# EAGLE design Bootselector (EAGLE 8.5.1)
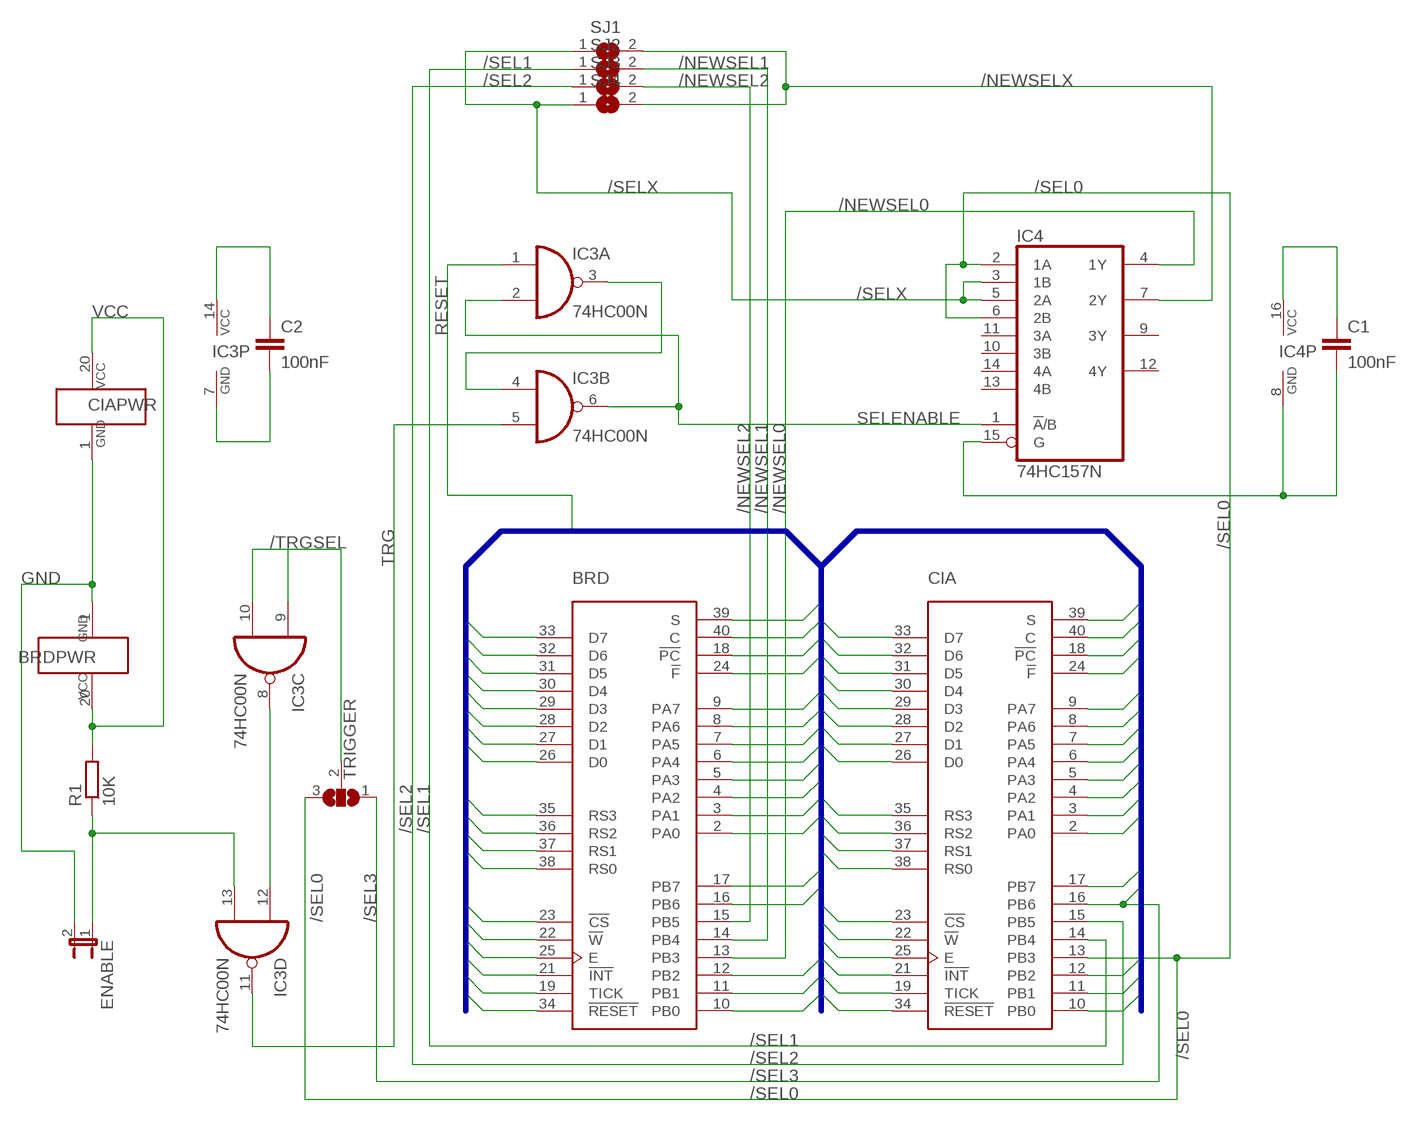
[diagram p0: schematic, sheet 1]

## Parts
BRD  CIA_DIP  [DIP40-6]
C1  100nF  C-EU050-025X075  [C050-025X075]
C2  100nF  C-EU050-025X075  [C050-025X075]
CIA  CIA_DIP  [DIP40-6]
ENABLE  JP1E  [JP1]
IC3  74HC00N  [DIL14]
IC4  74HC157N  [DIL16]
R1  10K  R-EU_0207/10  [0207/10]
SJ1  SJ  [SJ]
SJ2  SJ  [SJ]
SJ3  SJ  [SJ]
SJ4  SJ  [SJ]
TRIGGER  SJ2W  [SJ_2]

## Nets
/NEWSEL0: BRD.13(PB3) IC4.4(1Y)
/NEWSEL1: BRD.14(PB4) SJ2.2
/NEWSEL2: BRD.15(PB5) SJ3.2
/NEWSELX: IC4.7(2Y) SJ1.2 SJ4.2
/SEL0: CIA.13(PB3) IC4.2(1A) IC4.6(2B) TRIGGER.3
/SEL1: CIA.14(PB4) SJ2.1
/SEL2: CIA.15(PB5) SJ3.1
/SEL3: BRD.16(PB6) CIA.16(PB6) TRIGGER.1
/SELX: IC4.3(1B) IC4.5(2A) SJ1.1 SJ4.1
/TRGSEL: IC3.9(C:I0) IC3.10(C:I1) TRIGGER.2
C: BRD.40(C) CIA.40(C)
CS: BRD.23(!CS) CIA.23(!CS)
D0: BRD.26(D0) CIA.26(D0)
D1: BRD.27(D1) CIA.27(D1)
D2: BRD.28(D2) CIA.28(D2)
D3: BRD.29(D3) CIA.29(D3)
D4: BRD.30(D4) CIA.30(D4)
D5: BRD.31(D5) CIA.31(D5)
D6: BRD.32(D6) CIA.32(D6)
D7: BRD.33(D7) CIA.33(D7)
E: BRD.25(E) CIA.25(E)
F: BRD.24(!F) CIA.24(!F)
GND: BRD.1(GND1) C1.2 C2.2 CIA.1(GND1) ENABLE.2 IC3.7(P:GND) IC4.8(GND) IC4.15(G)
INT: BRD.21(!INT) CIA.21(!INT)
N$2: ENABLE.1 IC3.13(D:I1) R1.1
N$4: IC3.8(C:O) IC3.12(D:I0)
N$6: IC3.3(A:O) IC3.4(B:I0)
PA0: BRD.2(PA0) CIA.2(PA0)
PA1: BRD.3(PA1) CIA.3(PA1)
PA2: BRD.4(PA2) CIA.4(PA2)
PA3: BRD.5(PA3) CIA.5(PA3)
PA4: BRD.6(PA4) CIA.6(PA4)
PA5: BRD.7(PA5) CIA.7(PA5)
PA6: BRD.8(PA6) CIA.8(PA6)
PA7: BRD.9(PA7) CIA.9(PA7)
PB0: BRD.10(PB0) CIA.10(PB0)
PB1: BRD.11(PB1) CIA.11(PB1)
PB2: BRD.12(PB2) CIA.12(PB2)
PB7: BRD.17(PB7) CIA.17(PB7)
PC: BRD.18(!PC) CIA.18(!PC)
RESET: BRD.34(!RESET) CIA.34(!RESET) IC3.1(A:I0)
RS0: BRD.38(RS0) CIA.38(RS0)
RS1: BRD.37(RS1) CIA.37(RS1)
RS2: BRD.36(RS2) CIA.36(RS2)
RS3: BRD.35(RS3) CIA.35(RS3)
S: BRD.39(S) CIA.39(S)
SELENABLE: IC3.2(A:I1) IC3.6(B:O) IC4.1(!A!/B)
TICK: BRD.19(TICK) CIA.19(TICK)
TRG: IC3.5(B:I1) IC3.11(D:O)
VCC: BRD.20(VCC1) C1.1 C2.1 CIA.20(VCC1) IC3.14(P:VCC) IC4.16(VCC) R1.2
W: BRD.22(!W) CIA.22(!W)
Unconnected: IC4.9(3Y) IC4.10(3B) IC4.11(3A) IC4.12(4Y) IC4.13(4B) IC4.14(4A)

## Buses
D[0..7],PA[0..7],PB[0..2],PB[5..7],F,PC,C,S,RS[0..3],CS,W,E,INT,TICK,RESET

## Library data of the parts
BRD CIA = Amiga:CIA
C1 C2 = rcl:C-EU: CAPACITOR, European symbol
ENABLE = jumper:JP1E: JUMPER
IC3 = 74xx-eu:74*00: Quad 2-input NAND gate
IC4 = 74xx-eu:74*157: Quadruple 2-line to 1-line data SELECTOR/MULTIPLEXER
R1 = rcl:R-EU_: RESISTOR, European symbol
SJ1-SJ4 = jumper:SJ: SMD solder JUMPER
TRIGGER = jumper:SJ2W: SMD solder JUMPER

## Board
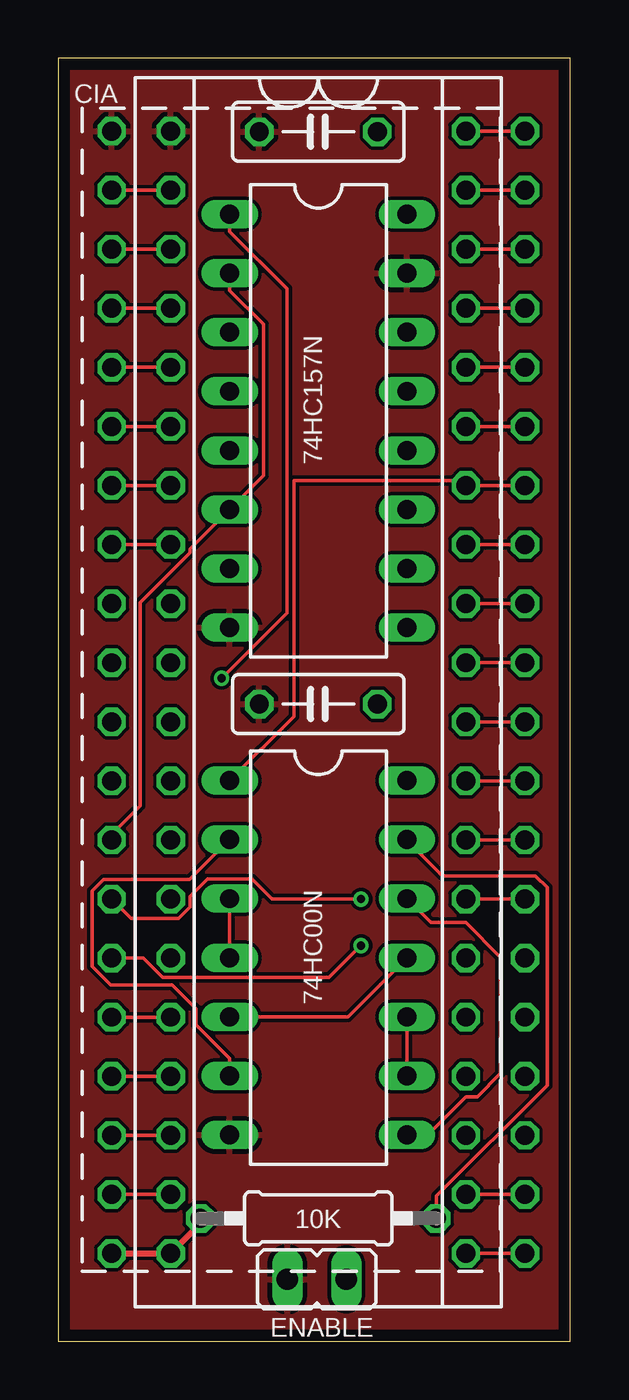
[diagram p1: board, top side]
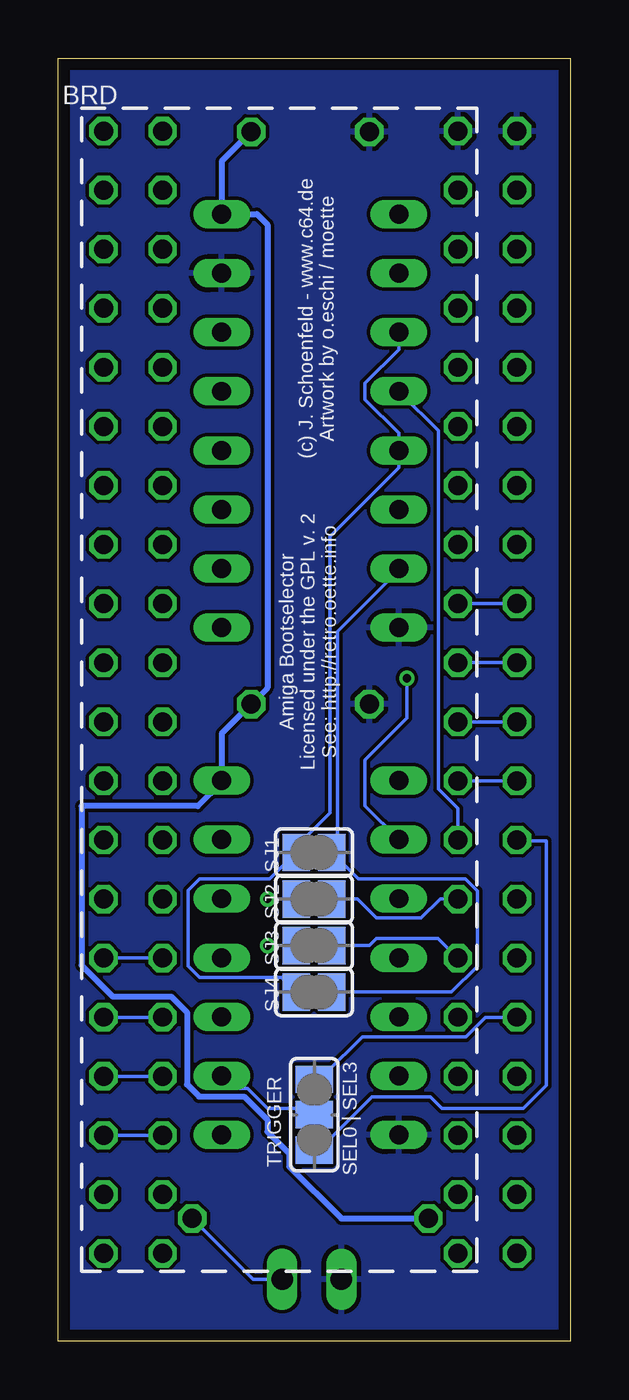
[diagram p2: board, bottom side, seen from below]

Size 22.04 x 55.17 mm. Coordinates in mm from the lower left corner, seen from the top.
Outline: 0,0 22.04,0 22.04,55.17 0,55.17 0,0
Copper layers (1*16): Top 0.035mm / dielectric 1.5mm / Bottom 0.035mm
Design rules "Eagle-DRU - 1203 - LeitOn - 01 and 02 layers": minimum track width 6mil, minimum drill 0.3mm, track to track 6mil, track to pad 6mil, pad to pad 6mil, via to via 6mil, smd to smd 6mil, copper to edge 20mil, drill to drill 10mil, minimum pad ring 8mil, minimum via ring 6mil, stop-mask expansion 3mil, vias tented up to drill 0mil, thermal gap 8mil

### Footprints (pad centres in the part's own frame; a part is rotated, then mirrored left to right if it is on the bottom)
DIP40-6 = drill 0.813 octagon: 1 -24.13,-7.62; 2 -21.59,-7.62; 3 -19.05,-7.62; 4 -16.51,-7.62; 5 -13.97,-7.62; 6 -11.43,-7.62; 7 -8.89,-7.62; 8 -6.35,-7.62; 9 -3.81,-7.62; 10 -1.27,-7.62; 11 1.27,-7.62; 12 3.81,-7.62; 13 6.35,-7.62; 14 8.89,-7.62; 15 11.43,-7.62; 16 13.97,-7.62; 17 16.51,-7.62; 18 19.05,-7.62; 19 21.59,-7.62; 20 24.13,-7.62; 21 24.13,7.62; 22 21.59,7.62; 23 19.05,7.62; 24 16.51,7.62; 25 13.97,7.62; 26 11.43,7.62; 27 8.89,7.62; 28 6.35,7.62; 29 3.81,7.62; 30 1.27,7.62; 31 -1.27,7.62; 32 -3.81,7.62; 33 -6.35,7.62; 34 -8.89,7.62; 35 -11.43,7.62; 36 -13.97,7.62; 37 -16.51,7.62; 38 -19.05,7.62; 39 -21.59,7.62; 40 -24.13,7.62
C050-025X075 = drill 0.813 octagon: 1 -2.54,0; 2 2.54,0
JP1 = drill 0.914 long: 1 0,-1.27; 2 0,1.27
DIL14 = drill 0.813 long: 1 -7.62,-3.81; 2 -5.08,-3.81; 3 -2.54,-3.81; 4 0,-3.81; 5 2.54,-3.81; 6 5.08,-3.81; 7 7.62,-3.81; 8 7.62,3.81; 9 5.08,3.81; 10 2.54,3.81; 11 0,3.81; 12 -2.54,3.81; 13 -5.08,3.81; 14 -7.62,3.81
DIL16 = drill 0.813 long: 1 -8.89,-3.81; 2 -6.35,-3.81; 3 -3.81,-3.81; 4 -1.27,-3.81; 5 1.27,-3.81; 6 3.81,-3.81; 7 6.35,-3.81; 8 8.89,-3.81; 9 8.89,3.81; 10 6.35,3.81; 11 3.81,3.81; 12 1.27,3.81; 13 -1.27,3.81; 14 -3.81,3.81; 15 -6.35,3.81; 16 -8.89,3.81
0207/10 = drill 0.813 octagon: 1 -5.08,0; 2 5.08,0
SJ = smd 1.168 x 1.6: 1 -0.762,0; 2 0.762,0
SJ_2 = smd 1.168 x 1.6: 1 -1.524,0; 2 0,0; 3 1.524,0

### Placement (x,y rotation side)
BRD  12.46,27.91 270 top
C1  11.19,52.01 180 top
C2  11.19,27.4 180 top
CIA  9.92,27.91 270 top
ENABLE  11.13,2.67 90 top
IC3  11.19,16.49 270 top
IC4  11.19,39.58 270 top
R1  11.19,5.29 180 top
SJ1  11.03,21.02 0 bottom
SJ2  11.03,19.02 0 bottom
SJ3  11.03,17.02 0 bottom
SJ4  11.03,15.02 0 bottom
TRIGGER  11.02,9.75 270 bottom

### Tracks (layer width: path | path; a pad name or v marks a point on that pad's centre or on a via)
/NEWSEL0
  Bottom 0.152: IC4.4 7.28,40.75 5.68,39.15 5.68,23.75 4.84,22.91 BRD.13
/NEWSEL1
  Bottom 0.152: BRD.14 5.6,19.02 6.42,18.2 8.34,18.2 9.16,19.02 SJ2.2
/NEWSEL2
  Bottom 0.152: SJ3.2 8.65,17.02 8.34,17.33 5.7,17.33 BRD.15
/NEWSELX
  Bottom 0.152: IC4.7 7.53,33.02 10.03,30.52 10.03,21.02 SJ1.2 9.13,19.87 4.51,19.87 4,19.36 4,16.13 5.12,15.02 SJ4.2
/SEL0
  Top 0.152: CIA.13 2.3,21.79 3.53,23.02 3.53,31.76 5.68,33.91 5.68,34.06 7.33,35.72 IC4.6 8.83,37.21 8.83,43.73 7.38,45.18 IC4.2
  Bottom 0.152: TRIGGER.3 10.53,8.52 8.53,10.52 6.03,10.52 5.53,10.02 2.03,10.02 1.03,11.02 1.03,21.52 2.03,21.52 CIA.13
/SEL1  (via drill 0.35)
  Top 0.152: v13.03,19.02 9.2,19.02 8.34,19.87 6.42,19.87 5.68,19.13 5.68,18.67 5.19,18.18 3.14,18.18 CIA.14
  Bottom 0.152: v13.03,19.02 SJ2.1
/SEL2  (via drill 0.35)
  Top 0.152: CIA.15 3.66,16.48 4.5,15.64 11.66,15.64 v13.03,17.02
  Bottom 0.152: v13.03,17.02 SJ3.1
/SEL3
  Top 0.152: BRD.16 CIA.16
  Bottom 0.152: TRIGGER.1 10.53,11.52 8.95,13.1 4.5,13.1 3.66,13.94 CIA.16
/SELX
  Bottom 0.152: IC4.3 7.38,42.64 8.83,41.19 8.83,40.5 7.38,39.05 IC4.5 7.38,37.56 10.34,34.61 10.34,22.71 12.03,21.02 SJ1.1 12.94,19.87 15.96,19.87 16.45,19.38 16.45,16.15 15.96,15.66 12.43,15.66 SJ4.1
/TRGSEL
  Top 0.152: IC3.10 IC3.9
  Bottom 0.152: TRIGGER.2 11.03,10.02 13.03,10.02 13.89,10.88 14.47,10.88 IC3.9
C
  Top 0.152: BRD.40 CIA.40
CS
  Bottom 0.152: BRD.23 CIA.23
D0
  Bottom 0.152: BRD.26 CIA.26
D1
  Top 0.152: CIA.27 18.03,19.02 20.03,19.02 BRD.27
D2
  Top 0.152: BRD.28 20.03,21.52 19.99,21.56 CIA.28
D3
  Top 0.152: BRD.29 CIA.29
D4
  Top 0.152: BRD.30 CIA.30
D5
  Top 0.152: CIA.31 BRD.31
D6
  Top 0.152: BRD.32 CIA.32
D7
  Top 0.152: CIA.33 BRD.33
E
  Bottom 0.152: BRD.25 CIA.25
F
  Bottom 0.152: CIA.24 BRD.24
GND
  pour Top: 22.03,55.02 0.03,55.02 0.03,0.02 22.03,0.02
  pour Bottom: 22.03,55.02 0.03,55.02 0.03,0.02 22.03,0.02
INT
  Top 0.152: CIA.21 BRD.21
N$2
  Top 0.152: IC3.13 15.03,21.52 16.53,20.02 20.53,20.02 21.03,19.52 21.03,11.02 16.27,6.26 R1.1
  Bottom 0.152: R1.1 13.65,2.67 ENABLE.1
N$4
  Top 0.152: IC3.8 15.03,9.02 16.03,9.02 17.53,10.52 18.03,10.52 19.03,11.52 19.03,16.52 17.53,18.02 16.03,18.02 15.03,19.02 IC3.12
N$6
  Top 0.152: IC3.3 IC3.4
PA0
  Top 0.152: CIA.2 BRD.2
PA1
  Top 0.152: CIA.3 BRD.3
PA2
  Top 0.152: CIA.4 BRD.4
PA3
  Top 0.152: BRD.5 CIA.5
PA4
  Top 0.152: CIA.6 BRD.6
PA5
  Top 0.152: CIA.7 BRD.7
PA6
  Top 0.152: CIA.8 BRD.8
PA7
  Bottom 0.152: CIA.9 BRD.9
PB0
  Bottom 0.152: CIA.10 BRD.10
PB1
  Bottom 0.152: CIA.11 BRD.11
PB2
  Bottom 0.152: CIA.12 BRD.12
PB7
  Top 0.152: CIA.17 BRD.17
PC
  Top 0.152: CIA.18 BRD.18
RESET
  Top 0.152: BRD.34 CIA.34 17.32,37.02 10.14,37.02 10.14,26.87 IC3.1
RS0
  Top 0.152: BRD.38 CIA.38
RS1
  Top 0.152: CIA.37 BRD.37
RS2
  Top 0.152: CIA.36 BRD.36
RS3
  Top 0.152: CIA.35 BRD.35
S
  Top 0.152: BRD.39 CIA.39
SELENABLE  (via drill 0.35)
  Top 0.152: IC4.1 7.38,47.72 9.84,45.27 9.84,31.31 v7.03,28.51 | IC3.6 7.38,12.16 5.93,13.61 5.93,14.3 4.9,15.34 2.26,15.34 1.46,16.13 1.46,19.36 1.96,19.86 5.66,19.86 IC3.2
  Bottom 0.152: v7.03,28.51 7.03,26.8 8.83,25 8.83,23.02 IC3.2
TICK
  Top 0.152: CIA.19 BRD.19
TRG
  Top 0.152: IC3.5 12.46,13.95 IC3.11
VCC
  Top 0.254: CIA.20 BRD.20 6.11,5.05 R1.2
  Bottom 0.152: 15.03,24.02 IC3.14
  Bottom 0.254: C1.1 15,50.74 IC4.16 13.48,48.47 13.03,48.02 13.03,28.1 C2.1 15,26.13 IC3.14 15,24.05 15.03,24.02 16.03,23.02 21.03,23.02 21.03,16.17 19.69,14.83 17.17,14.83 16.5,14.15 16.5,11.05 15.98,10.53 14.04,10.53 13.03,9.52 13.03,9.02 12.1,8.08 12.1,7.52 9.86,5.29 R1.2
W
  Top 0.152: CIA.22 BRD.22

### Text on the board
bPlace: BRD
bNames: (c) J. Schoenfeld - www.c64.de / Artwork by o.eschi / moette | Amiga Bootselector / Licensed under the GPL v. 2 / See: http://retro.oette.info | SEL0 | SEL3